# EAGLE schematic hvpp (EAGLE 6.5.0)
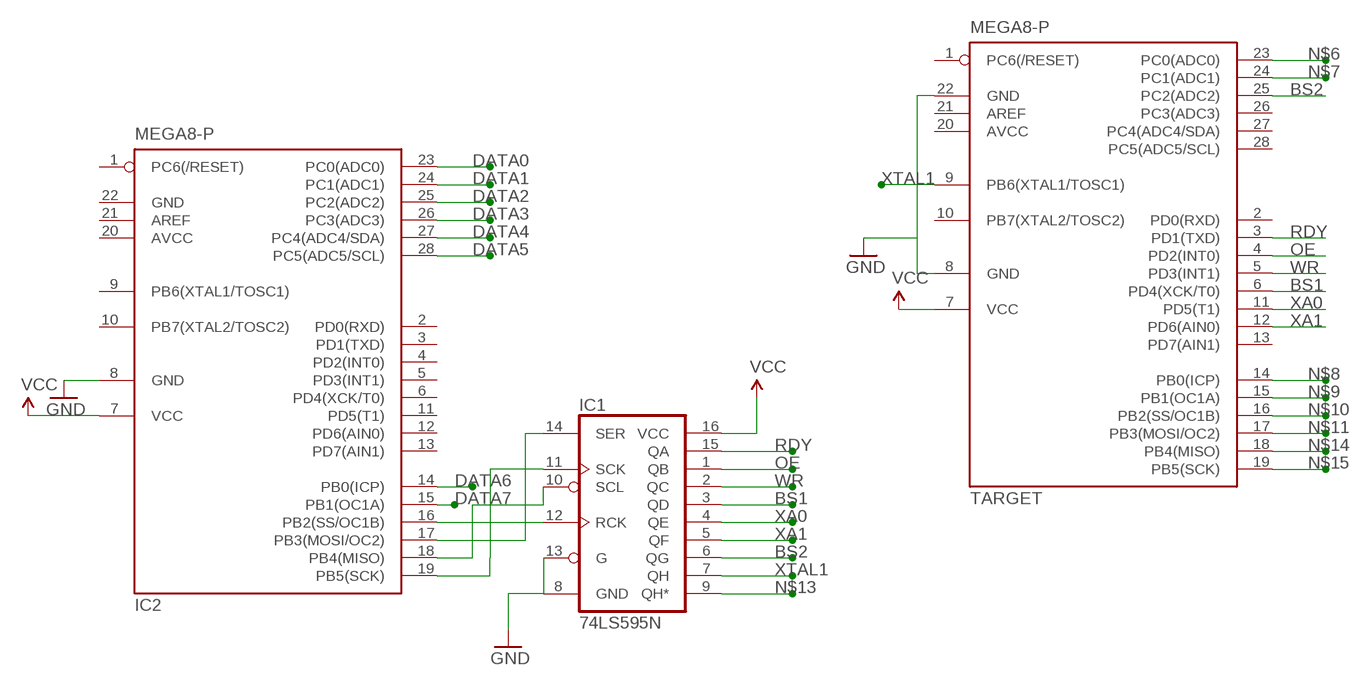
[diagram p0: schematic, sheet 1]

## Parts
IC1  74LS595N  [DIL16]
IC2  MEGA8-P  [DIL28-3]
TARGET  MEGA8-P  [DIL28-3]

## Nets
BS1: IC1.3(QD) TARGET.6(PD4(XCK/T0))
BS2: IC1.6(QG) TARGET.25(PC2(ADC2))
DATA0: IC2.23(PC0(ADC0))
DATA1: IC2.24(PC1(ADC1))
DATA2: IC2.25(PC2(ADC2))
DATA3: IC2.26(PC3(ADC3))
DATA4: IC2.27(PC4(ADC4/SDA))
DATA5: IC2.28(PC5(ADC5/SCL))
DATA6: IC2.14(PB0(ICP))
DATA7: IC2.15(PB1(OC1A))
GND: IC1.8(GND) IC1.13(G) IC2.8(GND) TARGET.8(GND) TARGET.22(GND)
N$1: IC1.11(SCK) IC2.19(PB5(SCK))
N$2: IC1.14(SER) IC2.17(PB3(MOSI/OC2))
N$3: IC1.12(RCK) IC2.16(PB2(SS/OC1B))
N$4: IC1.10(SCL) IC2.18(PB4(MISO))
N$6: TARGET.23(PC0(ADC0))
N$7: TARGET.24(PC1(ADC1))
N$8: TARGET.14(PB0(ICP))
N$9: TARGET.15(PB1(OC1A))
N$10: TARGET.16(PB2(SS/OC1B))
N$11: TARGET.17(PB3(MOSI/OC2))
N$13: IC1.9(QH*)
N$14: TARGET.18(PB4(MISO))
N$15: TARGET.19(PB5(SCK))
OE: IC1.1(QB) TARGET.4(PD2(INT0))
RDY: IC1.15(QA) TARGET.3(PD1(TXD))
VCC: IC1.16(VCC) IC2.7(VCC) TARGET.7(VCC)
WR: IC1.2(QC) TARGET.5(PD3(INT1))
XA0: IC1.4(QE) TARGET.11(PD5(T1))
XA1: IC1.5(QF) TARGET.12(PD6(AIN0))
XTAL1: IC1.7(QH) TARGET.9(PB6(XTAL1/TOSC1))
Unconnected: IC2.1(PC6(/RESET)) IC2.2(PD0(RXD)) IC2.3(PD1(TXD)) IC2.4(PD2(INT0)) IC2.5(PD3(INT1)) IC2.6(PD4(XCK/T0)) IC2.9(PB6(XTAL1/TOSC1)) IC2.10(PB7(XTAL2/TOSC2)) IC2.11(PD5(T1)) IC2.12(PD6(AIN0)) IC2.13(PD7(AIN1)) IC2.21(AREF) TARGET.1(PC6(/RESET)) TARGET.2(PD0(RXD)) TARGET.10(PB7(XTAL2/TOSC2)) TARGET.13(PD7(AIN1)) TARGET.21(AREF) TARGET.26(PC3(ADC3)) TARGET.27(PC4(ADC4/SDA)) TARGET.28(PC5(ADC5/SCL))

## Power pins joined to a net without a drawn wire
AVCC: IC2.20(AVCC) TARGET.20(AVCC)
GND: IC2.22(GND)

## Library data of the parts
IC1 = SparkFun:74*595: 8-bit SHIFT REGISTER, output latch
IC2 TARGET = atmel:MEGA8-P: MICROCONTROLLER 8 Kbytes FLASH, 1 kbytes SRAM, 512 bytes EEPROM, USART, 4-channel 10 bit ADC, 2-channel 8 bit ADC Pin compatible with Atmega48, ATMega88, ATMega168 Source: avr.lbr; OC_FARNELL: unknown; OC_NEWARK: unknown